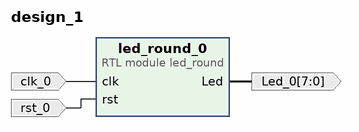
[diagram p0: block diagram of the top level]
# Vivado block design design_1, xc7z020clg484-1, Vivado 2018.3
create_bd_design design_1

create_bd_port -dir O -from 7 -to 0 Led_0
create_bd_port -dir I -type clk clk_0
create_bd_port -dir I -type rst rst_0

create_bd_cell -type module -reference led_round led_round_0

# ---- connections ----

connect_bd_net [get_bd_pins led_round_0/Led] [get_bd_ports Led_0]
connect_bd_net -net clk_0_1 [get_bd_ports clk_0] [get_bd_pins led_round_0/clk]
connect_bd_net -net rst_0_1 [get_bd_ports rst_0] [get_bd_pins led_round_0/rst]

validate_bd_design
save_bd_design
